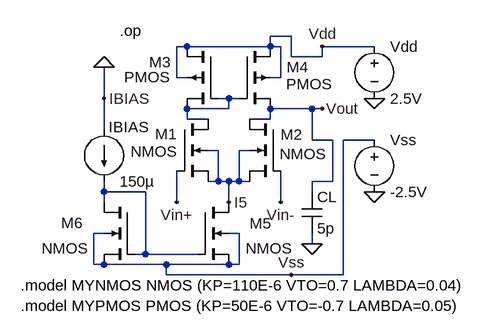
[diagram p0: schematic Ota.asc]
Ota.asc, the LTspice schematic file:
Version 4.1
SHEET 1 1412 2264
WIRE 320 0 288 0
WIRE 160 16 144 16
WIRE 288 16 288 0
WIRE 288 16 160 16
WIRE 304 16 288 16
WIRE 448 16 368 16
WIRE 320 32 320 0
WIRE 368 32 368 16
WIRE 368 32 320 32
WIRE 144 64 144 16
WIRE 160 64 144 64
WIRE 304 64 304 16
WIRE 304 64 288 64
WIRE 32 96 32 48
WIRE 224 96 208 96
WIRE 240 96 224 96
WIRE 224 112 224 96
WIRE 224 112 160 112
WIRE 352 112 288 112
WIRE 368 112 352 112
WIRE 160 128 160 112
WIRE 192 128 160 128
WIRE 288 128 288 112
WIRE 288 128 256 128
WIRE 32 144 32 96
WIRE 352 160 352 112
WIRE 384 160 352 160
WIRE 448 160 400 160
WIRE 208 176 192 176
WIRE 256 176 240 176
WIRE 208 224 208 176
WIRE 208 224 192 224
WIRE 224 224 208 224
WIRE 240 224 240 176
WIRE 240 224 224 224
WIRE 256 224 240 224
WIRE 384 224 384 160
WIRE 384 224 352 224
WIRE 32 240 32 224
WIRE 96 240 32 240
WIRE 352 240 352 224
WIRE 32 256 32 240
WIRE 144 256 144 208
WIRE 224 256 224 224
WIRE 304 256 304 208
WIRE 32 304 16 304
WIRE 240 304 224 304
WIRE 352 320 352 304
WIRE 96 336 96 240
WIRE 96 336 80 336
WIRE 176 336 96 336
WIRE 16 352 16 304
WIRE 32 352 16 352
WIRE 128 352 32 352
WIRE 224 352 128 352
WIRE 240 352 240 304
WIRE 240 352 224 352
WIRE 128 368 128 352
WIRE 320 368 128 368
WIRE 400 368 400 160
WIRE 400 368 320 368
FLAG 352 320 0
FLAG 320 368 Vss
FLAG 368 112 Vout
FLAG 224 256 I5
FLAG 32 96 IBIAS
FLAG 448 96 0
FLAG 368 16 Vdd
FLAG 448 240 0
FLAG 32 48 0
FLAG 304 256 Vin-
FLAG 144 256 Vin+
SYMBOL nmos4 304 128 M0
WINDOW 0 -34 24 Left 2
WINDOW 3 -70 54 Left 2
SYMATTR InstName M2
SYMBOL nmos4 144 128 R0
WINDOW 0 -33 23 Left 2
WINDOW 3 -71 50 Left 2
SYMATTR InstName M1
SYMBOL nmos4 176 256 R0
WINDOW 0 80 33 Left 2
WINDOW 3 74 71 Left 2
SYMATTR InstName M5
SYMBOL pmos4 240 16 R0
WINDOW 0 73 32 Left 2
WINDOW 3 72 58 Left 2
SYMATTR InstName M4
SYMBOL pmos4 208 16 M0
WINDOW 0 73 24 Left 2
WINDOW 3 74 47 Left 2
SYMATTR InstName M3
SYMBOL nmos4 80 256 M0
WINDOW 0 80 32 Left 2
WINDOW 3 72 71 Left 2
SYMATTR InstName M6
SYMBOL cap 336 240 R0
SYMATTR InstName CL
SYMATTR Value 5p
SYMBOL voltage 448 0 R0
SYMATTR InstName Vdd
SYMATTR Value 2.5V
SYMBOL voltage 448 144 R0
SYMATTR InstName Vss
SYMATTR Value -2.5V
SYMBOL current 32 144 R0
WINDOW 0 7 -4 Left 2
SYMATTR InstName IBIAS
SYMATTR Value 150µ
TEXT 56 -8 Left 2 !.op
TEXT -96 384 Left 2 !.model MYNMOS NMOS (KP=110E-6 VTO=0.7 LAMBDA=0.04)\n.model MYPMOS PMOS (KP=50E-6 VTO=-0.7 LAMBDA=0.05)

The netlist it stands for:
* Ota.asc
M2 Vout Vin- I5 I5 NMOS
M1 N001 Vin+ I5 I5 NMOS
M5 I5 N002 Vss Vss NMOS
M4 Vdd N001 Vout Vdd PMOS
M3 Vdd N001 N001 Vdd PMOS
M6 N002 N002 Vss Vss NMOS
CL Vout 0 5p
Vdd Vdd 0 2.5V
Vss Vss 0 -2.5V
IBIAS 0 N002 150µ
.model NMOS NMOS
.model PMOS PMOS
.lib standard.mos
.op
.model MYNMOS NMOS (KP=110E-6 VTO=0.7 LAMBDA=0.04)
.model MYPMOS PMOS (KP=50E-6 VTO=-0.7 LAMBDA=0.05)
.backanno
.end